# Altium project Offset_Attenuator.PrjPcb
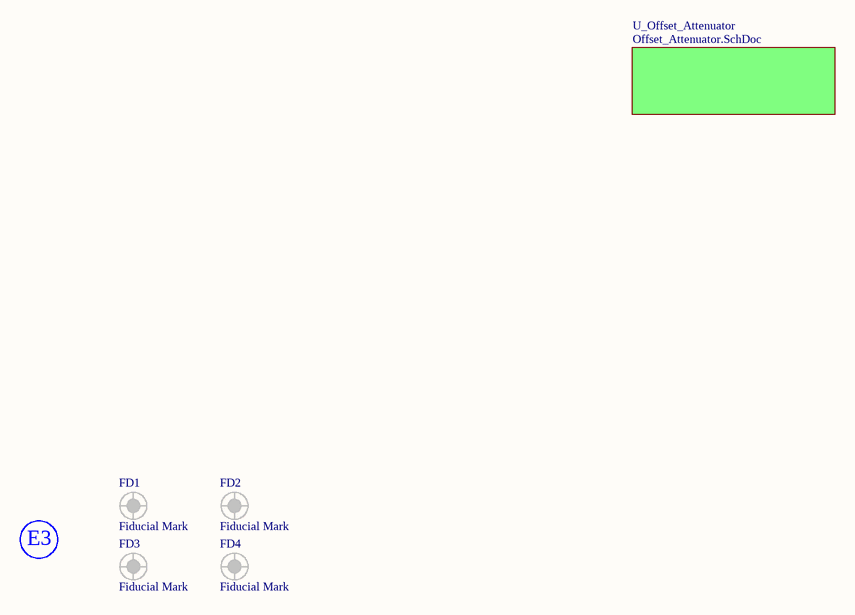
[diagram p0: [Top Sheet].SchDoc]
member1: Mathew Yerian-French; member2: Nicklas Koeller; project_id: Offset_Attenuator_Rev_1_0; project_name: Offset_Attenuator; revision: Rev. 1.0
2 sheets, 34 parts. Net scope: global (net labels, ports and power ports of the same name join across sheets).
Board file: Offset_Attenuator.PcbDoc
Sheets:
  [Top Sheet].SchDoc
    U_Offset_Attenuator = Offset_Attenuator.SchDoc

## Sheet [Top Sheet].SchDoc: Top Sheet
size A4; Organization: My Company; Address1: Address Line 1; Address2: Address Line 2; Address3: Address Line 3; Address4: Address Line 4; SheetNumber: 1; SheetTotal: 2

### Parts
FD1  Fiducial Mark  [Fiducial Mark]  (no BOM)
FD2  Fiducial Mark  [Fiducial Mark]  (no BOM)
FD3  Fiducial Mark  [Fiducial Mark]  (no BOM)
FD4  Fiducial Mark  [Fiducial Mark]  (no BOM)
  E3 Silk  [E3 Silk Screen]  (value not drawn)

### Sub-sheets
U_Offset_Attenuator = Offset_Attenuator.SchDoc: no entries

### Notes on the sheet
- Title:
- Engineer:
- Date:
- Variant:
- REV:
- Prj:
- Edited:
- Sheet:
- Approved By:
- Reviewed By:
- File:
- (in symbol E3 Silk) E3

### Library data of the parts
FD1-FD4 = Fiducial Mark: Manufacturer: Custom; Vendor: Custom; Manufacturer P/N: Fiducial Mark; Vendor P/N: Fiducial Mark

## Sheet Offset_Attenuator.SchDoc: Offset_Attenuator
size A4; Organization: My Company; Address1: Address Line 1; Address2: Address Line 2; Address3: Address Line 3; Address4: Address Line 4; SheetNumber: 2; SheetTotal: 2
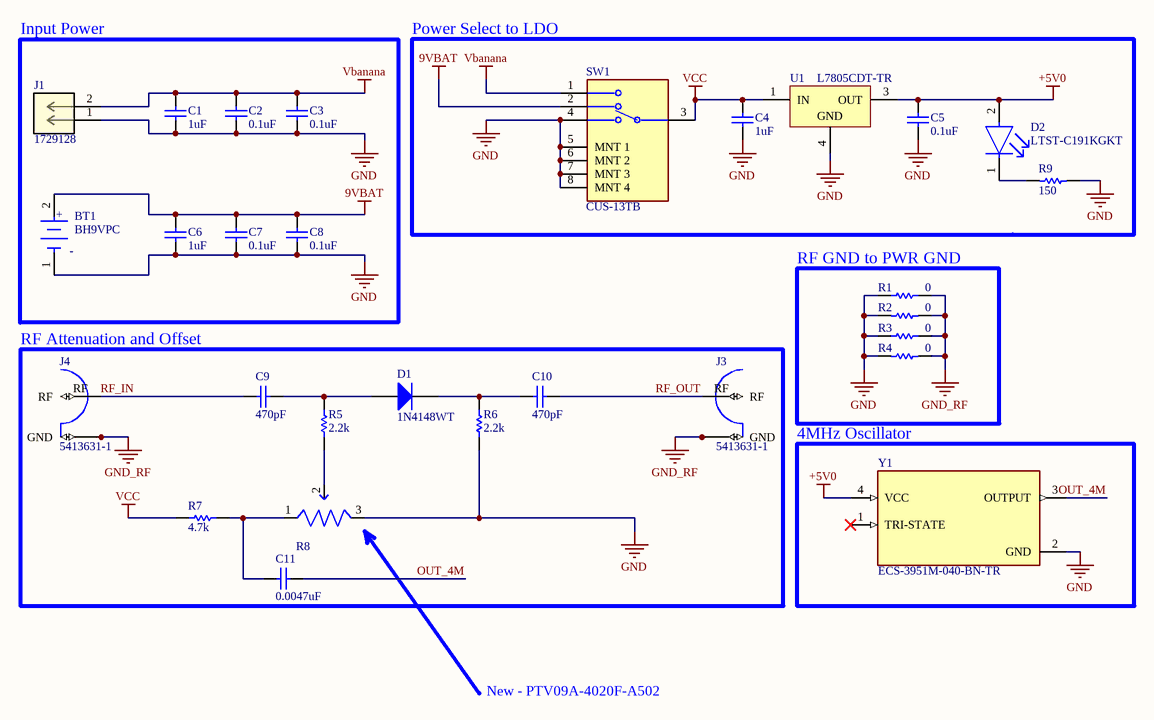
[diagram p1: Offset_Attenuator.SchDoc]

### Parts
BT1  BH9VPC  [FP-BH9VPC-MFG]
C1  value 1uF  [0603CAP]  (hidden comment: C0603)
C2  value 0.1uF  [0603CAP]  (hidden comment: C0603)
C3  value 0.1uF  [0603CAP]  (hidden comment: C0603)
C4  value 1uF  [0603CAP]  (hidden comment: C0603)
C5  value 0.1uF  [0603CAP]  (hidden comment: C0603)
C6  value 1uF  [0603CAP]  (hidden comment: C0603)
C7  value 0.1uF  [0603CAP]  (hidden comment: C0603)
C8  value 0.1uF  [0603CAP]  (hidden comment: C0603)
C9  value 470pF  [0402cap]  (hidden comment: C0402)
C10  value 470pF  [0402cap]  (hidden comment: C0402)
C11  value 0.0047uF  [0603CAP]  (hidden comment: C0603)
D1  1N4148WT  [FAIR-SOD-523F-2_V]
D2  LTST-C191KGKT  [FP-LTST-C191KGKT-MFG]
J1  1729128  [PHOE-1729128-2_V]
J3  5413631-1  [5413631-1]
J4  5413631-1  [5413631-1]
R1  value 0  [0805RES]  (hidden comment: R0805)
R2  value 0  [0805RES]  (hidden comment: R0805)
R3  value 0  [0805RES]  (hidden comment: R0805)
R4  value 0  [0805RES]  (hidden comment: R0805)
R5  CR1206F2K20P05Z: 2.2k  [RESC3216X60X45ML15T20]  (hidden comment: Resistor 0R +/- 5% 1206 250 mW)
R6  CR1206F2K20P05Z: 2.2k  [RESC3216X60X45ML15T20]  (hidden comment: Resistor 0R +/- 5% 1206 250 mW)
R7  RMC12064.7K5%N: 4.7k  [RESC3216X60X45ML15T20]  (hidden comment: Resistor 0R +/- 5% 1206 250 mW)
R8  EVU-F2LFL3D53  [EVU-F2LFL3D53]  (value not drawn)
R9  value 150  [0603RES]  (hidden comment: R0603)
SW1  CUS-13TB  [FP-CUS-13TB-MFG]
U1  L7805CDT-TR  [TO-252_N]
Y1  ECS-3951M-040-BN-TR  [OSC_ECS-3951M-040-BN-TR]

### Blocks framed on the sheet
Input Power: BT1 C1-C3 C6-C8 J1
Power Select to LDO: C4 C5 D2 R9 SW1 U1
RF GND to PWR GND: R1-R4
RF Attenuation and Offset: C9-C11 D1 J3 J4 R5-R8
4MHz Oscillator: Y1

### Nets
9VBAT: BT1.2(A) C6.2 C7.2 C8.2 SW1.2
+5V0: C5.2 D2.2(A) U1.3(OUT) Y1.4(VCC)
GND: BT1.1(C) C1.1 C2.1 C3.1 C4.1 C5.1 C6.1 C7.1 C8.1 J1.1 R1.1 R2.1 R3.1 R4.1 R6.1 R8.3 R9.2 SW1.4 SW1.5(MNT_1) SW1.6(MNT_2) SW1.7(MNT_3) SW1.8(MNT_4) U1.4(GND) Y1.2(GND)
GND_RF: J3.G1(GND) J3.G2(GND) J3.G3(GND) J3.G4(GND) J4.G1(GND) J4.G2(GND) J4.G3(GND) J4.G4(GND) R1.2 R2.2 R3.2 R4.2
Vbanana: C1.2 C2.2 C3.2 J1.2 SW1.1
VCC: C4.2 R7.2 SW1.3(C) U1.1(IN)
OUT_4M: C11.2 Y1.3(OUTPUT)
RF_IN: C9.1 J4.RF
RF_OUT: C10.2 J3.RF
NetC9_2: C9.2 D1.2(A) R5.2
NetC10_1: C10.1 D1.1(K) R6.2
NetC11_1: C11.1 R7.1 R8.1
NetD2_1: D2.1(C) R9.1
NetR5_1: R5.1 R8.2

Not connected (* = marked no-connect by the designer): Y1 1(TRI-STATE)*

### Notes on the sheet
- New - PTV09A-4020F-A502
- Title:
- Engineer:
- Date:
- Variant:
- REV:
- Prj:
- Edited:
- Sheet:
- Approved By:
- Reviewed By:
- File:
- (in symbol CMP-136216-000001-1) +; -

### Library data of the parts
BT1 = CMP-136216-000001-1: BATTERY HOLDER 9V PC PIN; Manufacturer: Memory Protection Devices; Description: Battery Holder (Open) 9V 1 Cell PC Pin; Conn Orientation: Vertical; Is Female: yes; Number Of Contacts: 2; Device Class L2: unset; Contact Material: Nickel; Device Class L1: Connectors; Lead Free: Yes; Digikey Description: BATTERY HOLDER 9V PC PIN; Category: Batt; ComponentLink2URL: http://www.memoryprotectiondevices.com/datasheets/BH9VPC-datasheet.pdf; Device Class L3: unset; Package: 0; Automotive: No; ComponentLink2Description: Datasheet; Height: 21.12mm; Voltage Rating: 9V; Octopart: https://octopart.com/bh9vpc-memory+protection+devices-22788154; RoHS: TRUE; Manufacturer Part Number: BH9VPC
C1-C8 C11 = C0603: 0603 Ceramic Chip Capacitor - Standard
C9 C10 = C0402: 0402 Ceramic Chip Capacitor - Standard
D1 = CMP-0881-00001-1: High Conductance Fast Switching Diode, 75 V, -55 to 150 degC, 2-Pin SOD523F, RoHS; Manufacturer: Fairchild Semiconductor; IR (VR: 75 V)=5 uA Max.; VF: 1 V Max.; BVR (IR: 5 uA)=75 V Min.; CO: 4 pF Max.; DatasheetVersion: Rev. A2; ComponentLink1Description: Manufacturer URL; PackageDescription: 2-Pin Surface Mount Device, Body 1.2 x 0.8 mm, Height 0.7 mm; ComponentLink2URL: http://www.fairchildsemi.com/ds/1N/1N4148WT.pdf; ComponentLink2Description: Datasheet; PartNumber: 1N4148WT; ComponentLink1URL: http://www.fairchildsemi.com/; Temperature Range: -55 to 150 degC; Mounting Technology: Surface Mount; PackageReference: SOD-523F-2; RoHS: TRUE
D2 = CMP-2000-05198-2: LED GREEN CLEAR SMD; Max Power Dissipation: 75mW; Forward Current: 30mA; Reverse Voltage: 5V; Lens Color: Colorless; Forward Voltage: 2V; Dominant Wavelength: 571nm; Number of LEDs: 1; Viewing Angle: 130°; Lens Style: Rectangular; Test Current: 20mA; Luminous Intensity: 35mcd; Wavelength: 574nm; Width: 0.8mm; Case Code (Imperial): 0603; Number of Pins: 2; Lead Free: Lead Free; Packaging: Tape and Reel; Package Quantity: 1; Min Operating Temperature: -55°C; Case/Package: 0603; Length: 1.6mm; Power Dissipation: 75mW; Depth: 0.8mm; Radiation Hardening: No; Mount: Surface Mount; Max Operating Temperature: 85°C; Color: Green; Power Rating: 75mW; Height: 0.55mm; Illumination Color: Green; Case Code (Metric): 1608; Lens Transparency: Clear; Number of Elements: 1
J1 = CMP-002-00071-1: Block, Terminal; 13.5 A; 250 V; 5.08 mm; 26 to 16 AWG; 2; Screw; Solder; 4 kV
J3 J4 = 5413631-1: Nickel Plating 50 Ohm Right Angle Metalized Jack PCB BNC Connector; MF: TE Connectivity; Number_of_Positions: 1; Price: None; MP: 5413631-1; EU_RoHS_Compliance: Compliant with Exemptions; SnapEDA_Link: https://www.snapeda.com/parts/5413631-1/TE%20Connectivity%20AMP%20Connectors/view-part/463831/?ref=snap; Availability: Unavailable; Package: None; TE_purchase_URL: https://www.te.com/usa-en/product-5413631-1.html?te_bu=Cor&te_type=disp&te_campaign=seda_glo_cor-seda-global-disp-prtnr-fy19-seda-model-bom-cta_sma-317_1&elqCampaignId=32493; Value: *
R1-R4 = R0805: 0805 Chip Resistor - Standard
R5-R7 = CMP-009-00002-5: Chip Resistor, 0 Ohm, +/- 5%, 0.25 W, -55 to 155 degC, 1206 (3216 Metric); Voltage Rating: 200V; Power: 250mW; Tolerance: 5%; Min Operating Temperature: -55°C; Mounting Technology: SM; Max Operating Temperature: 155°C; Case/Package: 1206; RoHS Compliant: True; Pins: 2
R9 = R0603: 0603 Chip Resistor - Standard
SW1 = CMP-71745-000014-1: SWITCH SLIDE SP3T 300MA 4V; Actuator Length: 1.5mm; Electrical Life: 10000Cycles; Max Voltage Rating (DC): 20V; Switch Function: On-On-On; Actuator Material: Nylon; Actuator Type: Standard; Contact Style: Non-Shorting; Contact Plating: Gold; Termination: Gull Wing; Radiation Hardening: No; Series: CUS; Max Operating Temperature: 70°C; Mount: Surface Mount; Switch Travel: 1.5mm; Packaging: Tape and Reel; Min Operating Temperature: -20°C; Contact Material: Copper Alloy; Orientation: Right Angle; Voltage Rating (DC): 4V; RoHS Compliant: Yes; Current Rating: 300mA; Throw Configuration: SP3T
U1 = CMP-0244-00216-1: Positive Voltage Regulator, 3-Pin DPAK, Tape and Reel; PackageVersion: 2011; PackageReference: TO-252; DatasheetVersion: 16/11/2011; PackageDescription: 3-Pin Transistor Outline Package 2.28 mm Pitch, 9.7 mm Lead Span (DPAK); ComponentLink1URL: http://www.st.com; ComponentLink2Description: Datasheet; ComponentLink1Description: Manufacturer URL; ComponentLink2URL: http://www.st.com/internet/com/TECHNICAL_RESOURCES/TECHNICAL_LITERATURE/DATASHEET/CD00000444.pdf
Y1 = ECS-3951M-040-BN-TR: SMD CLOCK OSCILLATOR; Package: None; Price: None; Value: *; MP: ECS-3951M-040-BN-TR; Availability: Unavailable

## Assembly variants
STANDARD CONFIG: all parts fitted